# EAGLE design scroogemote_v2 (EAGLE 5.12)
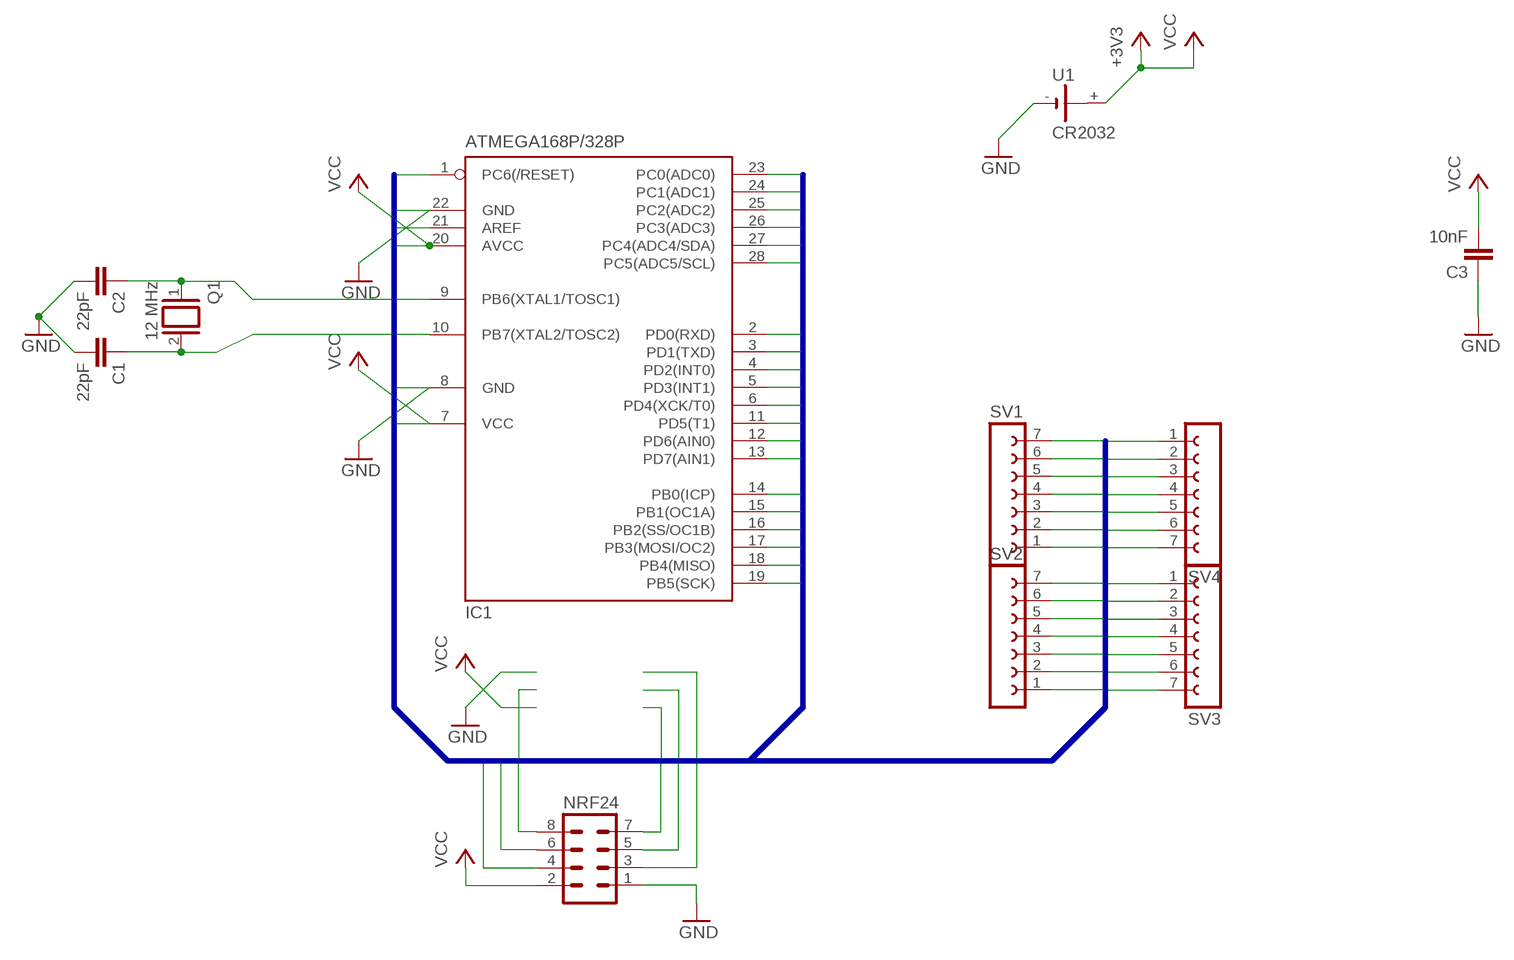
[diagram p0: schematic, sheet 1]

## Parts
C1  22pF  C2.5/2  [C2.5-2]
C2  22pF  C2.5/2  [C2.5-2]
C3  10nF  C2.5/2  [C2.5-2]
IC1  ATMEGA168P/328P  MEGA8-P  [DIL28-3]
NRF24  MA04-2  [MA04-2]
Q1  12 MHz  XTAL/S  [QS]
SV1  FE07-1  [FE07]
SV2  FE07-1  [FE07]
SV3  FE07-1  [FE07]
SV4  FE07-1  [FE07]
U1  CR2032  2032_V_SMALL  [V2032_THIN]

## Nets
GND [supply]: C1.2 C2.2 C3.1 NRF24.1 SV2.7 SV4.7 U1.-
MISO: IC1.18(PB4(MISO)) NRF24.7 SV3.4
MOSI: IC1.17(PB3(MOSI/OC2)) NRF24.6 SV3.5
N$1: C2.1 IC1.9(PB6(XTAL1/TOSC1)) Q1.1
N$2: C1.1 IC1.10(PB7(XTAL2/TOSC2)) Q1.2
NRESET: IC1.1(PC6(/RESET)) SV1.7
PIN2: IC1.2(PD0(RXD)) SV1.6
PIN3: IC1.3(PD1(TXD)) SV1.5
PIN4: IC1.4(PD2(INT0)) SV1.4
PIN5: IC1.5(PD3(INT1)) NRF24.8 SV1.3
PIN6: IC1.6(PD4(XCK/T0)) SV1.2
PIN9: SV2.6
PIN10: SV2.5
PIN11: IC1.11(PD5(T1)) SV2.4
PIN12: IC1.12(PD6(AIN0)) SV2.3
PIN13: IC1.13(PD7(AIN1)) SV2.2
PIN14: IC1.14(PB0(ICP)) NRF24.4 SV2.1
PIN15: IC1.15(PB1(OC1A)) NRF24.3 SV3.7
PIN16: IC1.16(PB2(SS/OC1B)) SV3.6
PIN21: IC1.21(AREF) SV3.1
PIN23: IC1.23(PC0(ADC0)) SV4.6
PIN24: IC1.24(PC1(ADC1)) SV4.5
PIN25: IC1.25(PC2(ADC2)) SV4.4
PIN26: IC1.26(PC3(ADC3)) SV4.3
PIN27: IC1.27(PC4(ADC4/SDA)) SV4.2
PIN28: IC1.28(PC5(ADC5/SCL)) SV4.1
SCK: IC1.19(PB5(SCK)) NRF24.5 SV3.3
VCC [supply]: C3.2 IC1.20(AVCC) NRF24.2 SV1.1 SV3.2 U1.+ ; supply symbol labelled +3V3
Unconnected: U1.+@1(+)

## Buses
PIN[1..28],MISO,MOSI,SCK,NRESET

## Power pins joined to a net without a drawn wire
GND: IC1.8(GND) IC1.22(GND)
VCC: IC1.7(VCC)

## Library data of the parts
C1-C3 = capacitor-wima:C: CAPACITOR naming: grid - package width
IC1 = atmel:MEGA8-P: MICROCONTROLLER 8 Kbytes FLASH, 1 kbytes SRAM, 512 bytes EEPROM, USART, 4-channel 10 bit ADC, 2-channel 8 bit ADC Pin compatible with Atmega48, ATMega88, ATMega168 Source: avr.lbr; OC_FARNELL: unknown; OC_NEWARK: unknown
NRF24 = con-lstb:MA04-2: PIN HEADER; OC_FARNELL: unknown; OC_NEWARK: unknown
Q1 = special:XTAL/S: CRYSTAL
SV1-SV4 = con-lsta:FE07-1: FEMALE HEADER; OC_FARNELL: unknown; OC_NEWARK: unknown
U1 = coin_cell:2032_V_SMALL

## Net classes
0 default: width 0.203 mm, clearance 0.203 mm
1 supply: width 0.406 mm, clearance 0.203 mm

## Board
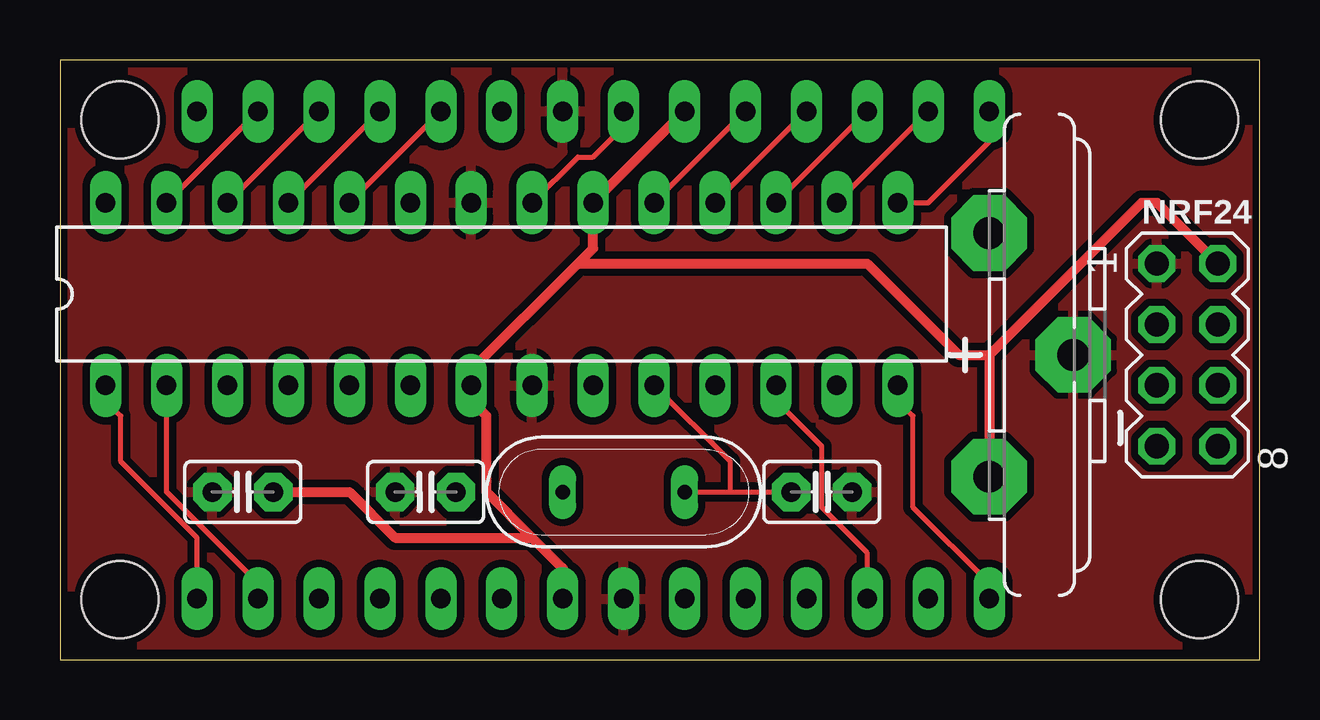
[diagram p1: board, top side]
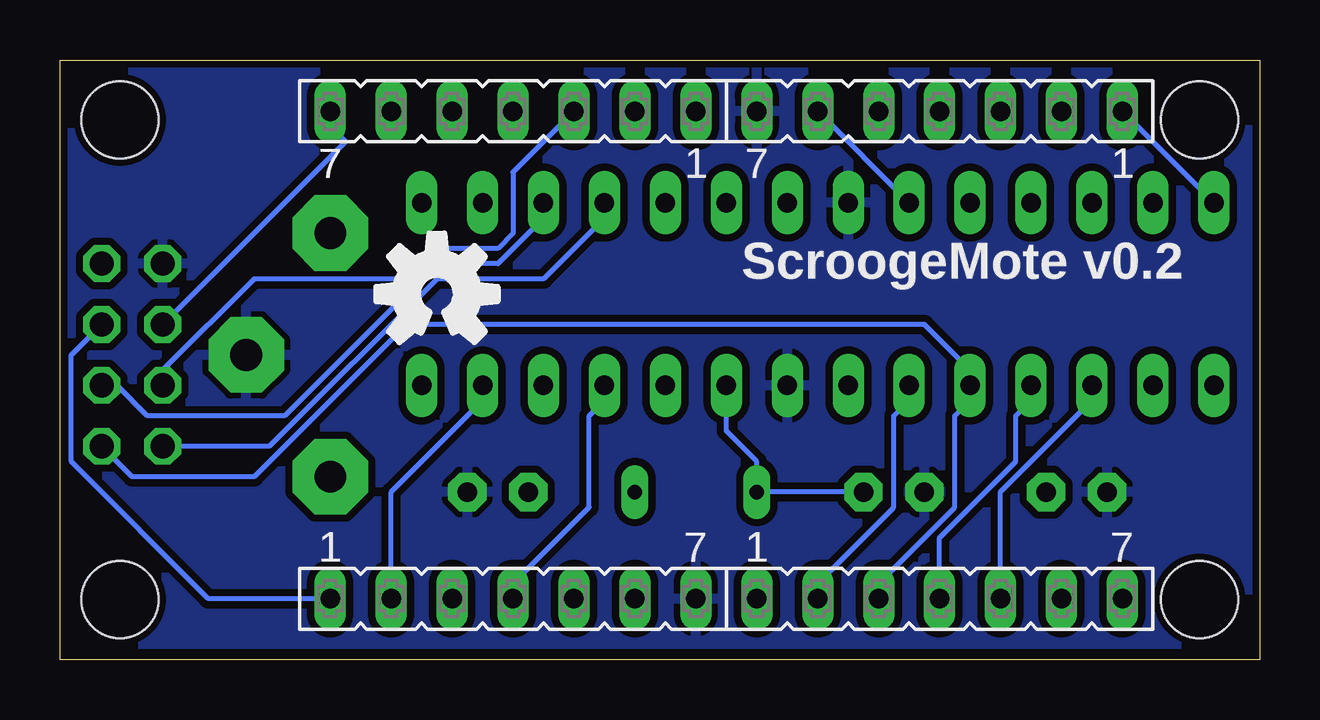
[diagram p2: board, bottom side, seen from below]

Size 50 x 25 mm. Coordinates in mm from the lower left corner, seen from the top.
Outline: 0,0 50,0 50,25 0,25 0,0
Copper layers (1*16): Top 0.035mm / dielectric 1.5mm / Bottom 0.035mm
Design rules "ITEADstudio_DRC *": minimum track width 6mil, minimum drill 12mil, track to track 6mil, track to pad 6mil, pad to pad 6mil, via to via 6mil, smd to smd 0mil, copper to edge 10mil, drill to drill 10mil, minimum pad ring 10mil, minimum via ring 6mil, stop-mask expansion 2mil, vias tented up to drill 100mil, thermal gap 10mil
Holes 3.2 mm at 2.5,2.5 47.5,2.5 47.5,22.5 2.5,22.5

### Footprints (pad centres in the part's own frame; a part is rotated, then mirrored left to right if it is on the bottom)
C2.5-2 = drill 0.813 pad 1.6 octagon: 1 -1.27,0; 2 1.27,0
DIL28-3 = drill 0.813 long: 1 -16.51,-3.81; 2 -13.97,-3.81; 3 -11.43,-3.81; 4 -8.89,-3.81; 5 -6.35,-3.81; 6 -3.81,-3.81; 7 -1.27,-3.81; 8 1.27,-3.81; 9 3.81,-3.81; 10 6.35,-3.81; 11 8.89,-3.81; 12 11.43,-3.81; 13 13.97,-3.81; 14 16.51,-3.81; 15 16.51,3.81; 16 13.97,3.81; 17 11.43,3.81; 18 8.89,3.81; 19 6.35,3.81; 20 3.81,3.81; 21 1.27,3.81; 22 -1.27,3.81; 23 -3.81,3.81; 24 -6.35,3.81; 25 -8.89,3.81; 26 -11.43,3.81; 27 -13.97,3.81; 28 -16.51,3.81
MA04-2 = drill 1.016 octagon: 1 -3.81,-1.27; 2 -3.81,1.27; 3 -1.27,-1.27; 4 -1.27,1.27; 5 1.27,-1.27; 6 1.27,1.27; 7 3.81,-1.27; 8 3.81,1.27
QS = drill 0.61 long: 1 -2.54,0; 2 2.54,0
FE07 = drill 0.813 long: 1 -7.62,0; 2 -5.08,0; 3 -2.54,0; 4 0,0; 5 2.54,0; 6 5.08,0; 7 7.62,0
V2032_THIN = drill 1.321 pad 3.15 octagon: + 1.27,-5.08; +@1 1.27,5.08; - 4.771,0

### Placement (x,y rotation side)
C1  31.75,6.99 0 top
C2  15.24,6.99 180 top
C3  7.62,6.99 0 top
IC1  18.41,15.24 0 top
NRF24  46.99,12.7 270 top
Q1  23.5,6.99 0 top
SV1  13.34,2.54 0 bottom
SV2  31.11,2.54 0 bottom
SV3  31.11,22.86 180 bottom
SV4  13.34,22.86 180 bottom
U1  37.47,12.7 0 top

### Tracks (layer width: path | path; a pad name or v marks a point on that pad's centre or on a via)
GND
  pour Bottom (isolate 0.305): 0,0.64 49.97,0.64 49.97,24.96 0,24.96
  pour Top (isolate 0.305): 0,0.64 49.97,0.64 49.97,24.96 0,24.96
MISO
  Top 0.203: IC1.18 SV3.4
  Bottom 0.203: NRF24.7 41.27,8.89 34.29,15.88 29.84,15.88 27.3,18.41 IC1.18
MOSI
  Top 0.203: IC1.17 SV3.5
  Bottom 0.203: NRF24.6 47.62,11.43 46.35,10.16 40.64,10.16 34.29,16.51 31.75,16.51 29.84,18.41 IC1.17
N$1
  Bottom 0.203: C2.1 Q1.1 20.95,8.26 22.23,9.53 IC1.9
N$2
  Top 0.203: 27.94,6.99 C1.1 | Q1.2 27.94,6.99 | IC1.10 27.94,8.26 27.94,6.99
NRESET
  Top 0.203: SV1.7 5.71,5.08 2.54,8.26 2.54,10.16 1.91,10.79 IC1.1
PIN2
  Top 0.203: SV1.6 8.26,3.17 4.45,6.99 IC1.2
PIN3
  Bottom 0.203: SV1.5 10.79,6.99 6.99,10.79 IC1.3
PIN4
  Bottom 0.203: SV1.4 13.34,5.08 10.16,8.26 10.16,10.16 9.53,10.79 IC1.4
PIN5
  Bottom 0.203: SV1.3 15.88,3.17 12.7,6.35 12.7,10.16 12.06,10.79 IC1.5 12.06,12.06 13.97,13.97 35.56,13.97 41.91,7.62 46.99,7.62 NRF24.8
PIN6
  Bottom 0.203: SV1.2 18.41,3.17 15.24,6.35 15.24,10.16 14.61,10.79 IC1.6
PIN11
  Bottom 0.203: SV2.4 31.11,3.17 27.94,6.35 27.94,10.16 27.3,10.79 IC1.11
PIN12
  Top 0.203: SV2.3 33.66,4.45 31.75,6.35 31.75,8.89 29.84,10.79 IC1.12
PIN13
  Bottom 0.203: SV2.2 36.2,6.99 32.38,10.79 IC1.13
PIN14
  Top 0.203: SV2.1 38.73,3.17 35.56,6.35 35.56,10.16 34.92,10.79 IC1.14
  Bottom 0.203: NRF24.4 49.53,12.7 49.53,8.26 43.81,2.54 SV2.1
PIN15
  Top 0.203: IC1.15 36.2,19.05 38.73,21.59 SV3.7
  Bottom 0.203: NRF24.3 38.1,21.59 38.73,22.23 SV3.7
PIN16
  Top 0.203: IC1.16 SV3.6
PIN21
  Top 0.203: IC1.21 21.59,20.95 22.23,20.95 23.5,22.23 SV3.1
PIN23
  Bottom 0.203: IC1.23 SV4.6
PIN24
  Top 0.203: IC1.24 SV4.5
PIN25
  Top 0.203: IC1.25 SV4.4
PIN26
  Top 0.203: IC1.26 SV4.3
PIN27
  Top 0.203: IC1.27 SV4.2
PIN28
  Bottom 0.203: IC1.28 SV4.1
SCK
  Top 0.203: IC1.19 SV3.3
  Bottom 0.203: NRF24.5 45.72,12.06 41.91,15.88 35.56,15.88 34.29,17.14 31.75,17.14 31.11,17.78 31.11,20.32 SV3.3
VCC
  Top 0.406: NRF24.2 45.72,19.05 45.09,19.05 38.73,12.7 | 38.73,12.7 U1.+ | SV3.2 IC1.20 22.23,17.14 21.59,16.51 | SV1.1 20.95,3.81 19.68,5.08 | 19.68,5.08 17.78,6.99 17.78,10.16 17.14,10.79 IC1.7 17.14,12.06 21.59,16.51 | C3.2 12.06,6.99 13.97,5.08 19.68,5.08 | 38.73,12.7 37.47,12.7 33.66,16.51 21.59,16.51

### Text on the board
bNames: ScroogeMote v0.2